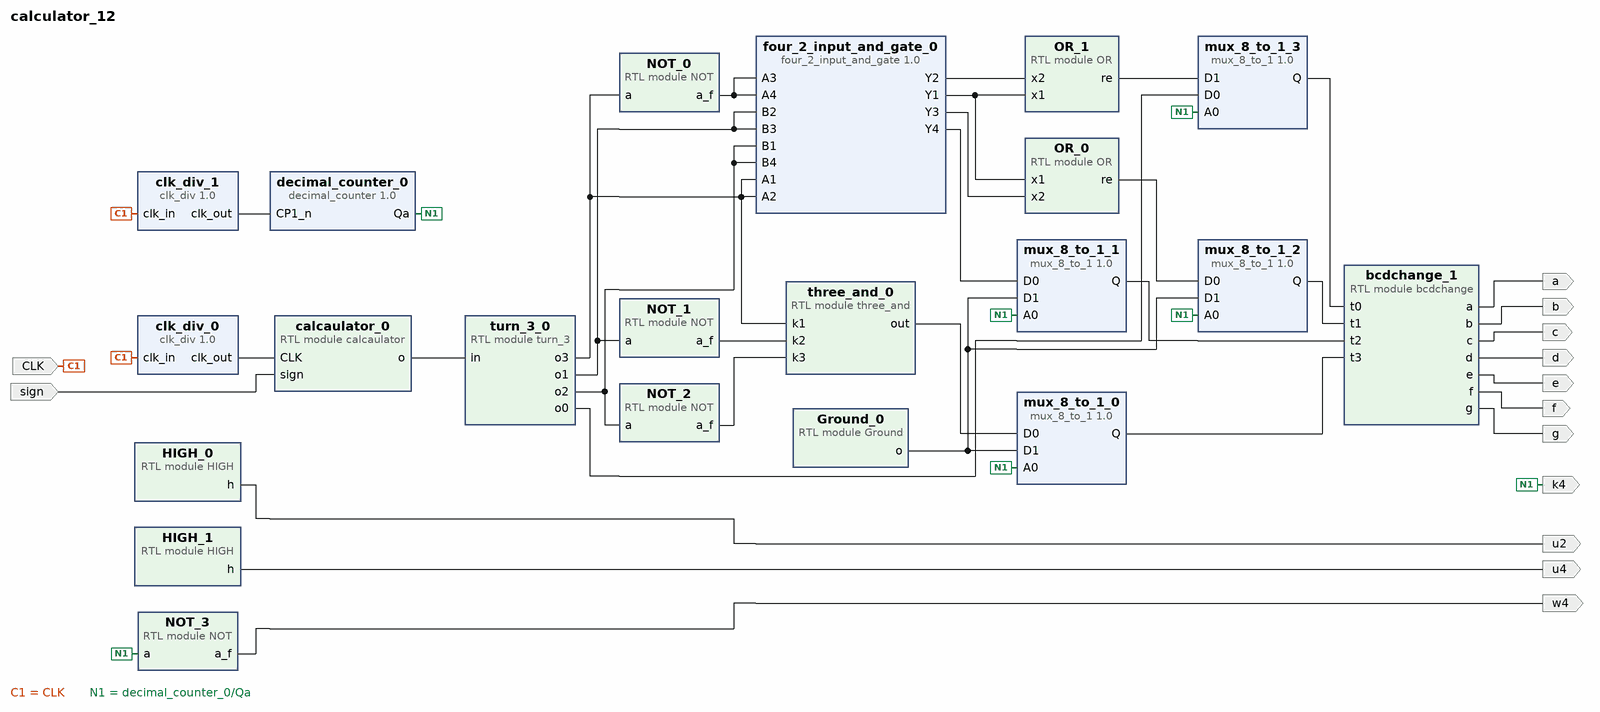
[diagram p0: block diagram of the top level]
# Vivado block design calculator_12, xc7a35tcpg236-1, Vivado 2017.2
create_bd_design calculator_12

create_bd_port -dir I sign
create_bd_port -dir I -type clk CLK
create_bd_port -dir O a
create_bd_port -dir O b
create_bd_port -dir O c
create_bd_port -dir O d
create_bd_port -dir O e
create_bd_port -dir O f
create_bd_port -dir O g
create_bd_port -dir O u2
create_bd_port -dir O u4
create_bd_port -dir O k4
create_bd_port -dir O w4

create_bd_cell -type ip -vlnv xilinx.com:xup:clk_div:1.0 clk_div_0
set_property -dict {CONFIG.N 100000000} [get_bd_cells clk_div_0]
create_bd_cell -type ip -vlnv xilinx.com:XUP:four_2_input_and_gate:1.0 four_2_input_and_gate_0
create_bd_cell -type ip -vlnv xilinx.com:xup:mux_8_to_1:1.0 mux_8_to_1_0
create_bd_cell -type ip -vlnv xilinx.com:xup:decimal_counter:1.0 decimal_counter_0
create_bd_cell -type ip -vlnv xilinx.com:xup:clk_div:1.0 clk_div_1
set_property -dict {CONFIG.N 999999} [get_bd_cells clk_div_1]
create_bd_cell -type ip -vlnv xilinx.com:xup:mux_8_to_1:1.0 mux_8_to_1_1
create_bd_cell -type ip -vlnv xilinx.com:xup:mux_8_to_1:1.0 mux_8_to_1_2
create_bd_cell -type ip -vlnv xilinx.com:xup:mux_8_to_1:1.0 mux_8_to_1_3
create_bd_cell -type module -reference Ground Ground_0
create_bd_cell -type module -reference NOT NOT_0
create_bd_cell -type module -reference NOT NOT_1
create_bd_cell -type module -reference NOT NOT_2
create_bd_cell -type module -reference OR OR_0
create_bd_cell -type module -reference OR OR_1
create_bd_cell -type module -reference bcdchange bcdchange_1
create_bd_cell -type module -reference calcaulator calcaulator_0
create_bd_cell -type module -reference three_and three_and_0
create_bd_cell -type module -reference turn_3 turn_3_0
create_bd_cell -type module -reference HIGH HIGH_0
create_bd_cell -type module -reference HIGH HIGH_1
create_bd_cell -type module -reference NOT NOT_3

# ---- connections ----

connect_bd_net [get_bd_ports sign] [get_bd_pins calcaulator_0/sign]
connect_bd_net [get_bd_ports CLK] [get_bd_pins clk_div_0/clk_in] [get_bd_pins clk_div_1/clk_in]
connect_bd_net [get_bd_pins clk_div_0/clk_out] [get_bd_pins calcaulator_0/CLK]
connect_bd_net [get_bd_pins calcaulator_0/o] [get_bd_pins turn_3_0/in]
connect_bd_net [get_bd_pins turn_3_0/o3] \
  [get_bd_pins four_2_input_and_gate_0/A1] [get_bd_pins four_2_input_and_gate_0/A2] [get_bd_pins NOT_0/a] \
  [get_bd_pins three_and_0/k1]
connect_bd_net [get_bd_pins turn_3_0/o2] [get_bd_pins four_2_input_and_gate_0/B1] [get_bd_pins four_2_input_and_gate_0/B4] [get_bd_pins NOT_2/a]
connect_bd_net [get_bd_pins four_2_input_and_gate_0/Y1] [get_bd_pins OR_0/x1] [get_bd_pins OR_1/x1]
connect_bd_net [get_bd_pins turn_3_0/o1] [get_bd_pins four_2_input_and_gate_0/B2] [get_bd_pins four_2_input_and_gate_0/B3] [get_bd_pins NOT_1/a]
connect_bd_net [get_bd_pins four_2_input_and_gate_0/Y2] [get_bd_pins OR_1/x2]
connect_bd_net [get_bd_pins NOT_0/a_f] [get_bd_pins four_2_input_and_gate_0/A3] [get_bd_pins four_2_input_and_gate_0/A4]
connect_bd_net [get_bd_pins four_2_input_and_gate_0/Y3] [get_bd_pins OR_0/x2]
connect_bd_net [get_bd_pins NOT_1/a_f] [get_bd_pins three_and_0/k2]
connect_bd_net [get_bd_pins NOT_2/a_f] [get_bd_pins three_and_0/k3]
connect_bd_net [get_bd_pins decimal_counter_0/Qa] \
  [get_bd_pins mux_8_to_1_0/A0] [get_bd_pins mux_8_to_1_1/A0] [get_bd_pins mux_8_to_1_2/A0] [get_bd_pins mux_8_to_1_3/A0] \
  [get_bd_ports k4] [get_bd_pins NOT_3/a]
connect_bd_net [get_bd_pins Ground_0/o] [get_bd_pins mux_8_to_1_0/D1] [get_bd_pins mux_8_to_1_1/D1] [get_bd_pins mux_8_to_1_2/D1]
connect_bd_net [get_bd_pins three_and_0/out] [get_bd_pins mux_8_to_1_0/D0]
connect_bd_net [get_bd_pins clk_div_1/clk_out] [get_bd_pins decimal_counter_0/CP1_n]
connect_bd_net [get_bd_pins four_2_input_and_gate_0/Y4] [get_bd_pins mux_8_to_1_1/D0]
connect_bd_net [get_bd_pins OR_0/re] [get_bd_pins mux_8_to_1_2/D0]
connect_bd_net [get_bd_pins OR_1/re] [get_bd_pins mux_8_to_1_3/D1]
connect_bd_net [get_bd_pins turn_3_0/o0] [get_bd_pins mux_8_to_1_3/D0]
connect_bd_net [get_bd_pins mux_8_to_1_3/Q] [get_bd_pins bcdchange_1/t0]
connect_bd_net [get_bd_pins mux_8_to_1_2/Q] [get_bd_pins bcdchange_1/t1]
connect_bd_net [get_bd_pins mux_8_to_1_1/Q] [get_bd_pins bcdchange_1/t2]
connect_bd_net [get_bd_pins mux_8_to_1_0/Q] [get_bd_pins bcdchange_1/t3]
connect_bd_net [get_bd_pins bcdchange_1/a] [get_bd_ports a]
connect_bd_net [get_bd_pins bcdchange_1/b] [get_bd_ports b]
connect_bd_net [get_bd_pins bcdchange_1/c] [get_bd_ports c]
connect_bd_net [get_bd_pins bcdchange_1/d] [get_bd_ports d]
connect_bd_net [get_bd_pins bcdchange_1/e] [get_bd_ports e]
connect_bd_net [get_bd_pins bcdchange_1/f] [get_bd_ports f]
connect_bd_net [get_bd_pins bcdchange_1/g] [get_bd_ports g]
connect_bd_net [get_bd_pins HIGH_0/h] [get_bd_ports u2]
connect_bd_net [get_bd_pins HIGH_1/h] [get_bd_ports u4]
connect_bd_net [get_bd_pins NOT_3/a_f] [get_bd_ports w4]

validate_bd_design
save_bd_design
